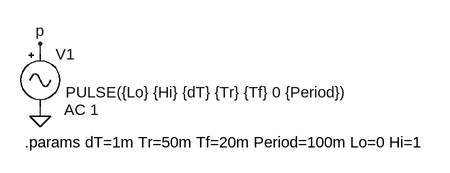
[diagram p0: schematic GenLineB.asc]
GenLineB.asc, the LTspice schematic file:
Version 4
SHEET 1 880 680
WIRE 48 96 48 80
WIRE 48 192 48 176
FLAG 48 192 0
FLAG 48 80 p
SYMBOL Misc\\signal 48 80 R0
WINDOW 123 37 102 Left 0
WINDOW 39 0 0 Left 0
WINDOW 3 39 75 Left 0
SYMATTR Value2 AC 1
SYMATTR InstName V1
SYMATTR Value PULSE({Lo} {Hi} {dT} {Tr} {Tf} 0 {Period})
TEXT 24 232 Left 0 !.params dT=1m Tr=50m Tf=20m Period=100m Lo=0 Hi=1

The netlist it stands for:
* GenLineB.asc
V1 p 0 PULSE({Lo} {Hi} {dT} {Tr} {Tf} 0 {Period}) AC 1
.params dT=1m Tr=50m Tf=20m Period=100m Lo=0 Hi=1
.backanno
.end